# Altium schematic sheet MezzanineConnectors.SchDoc
size A3; SheetNumber: 2; SheetTotal: 6
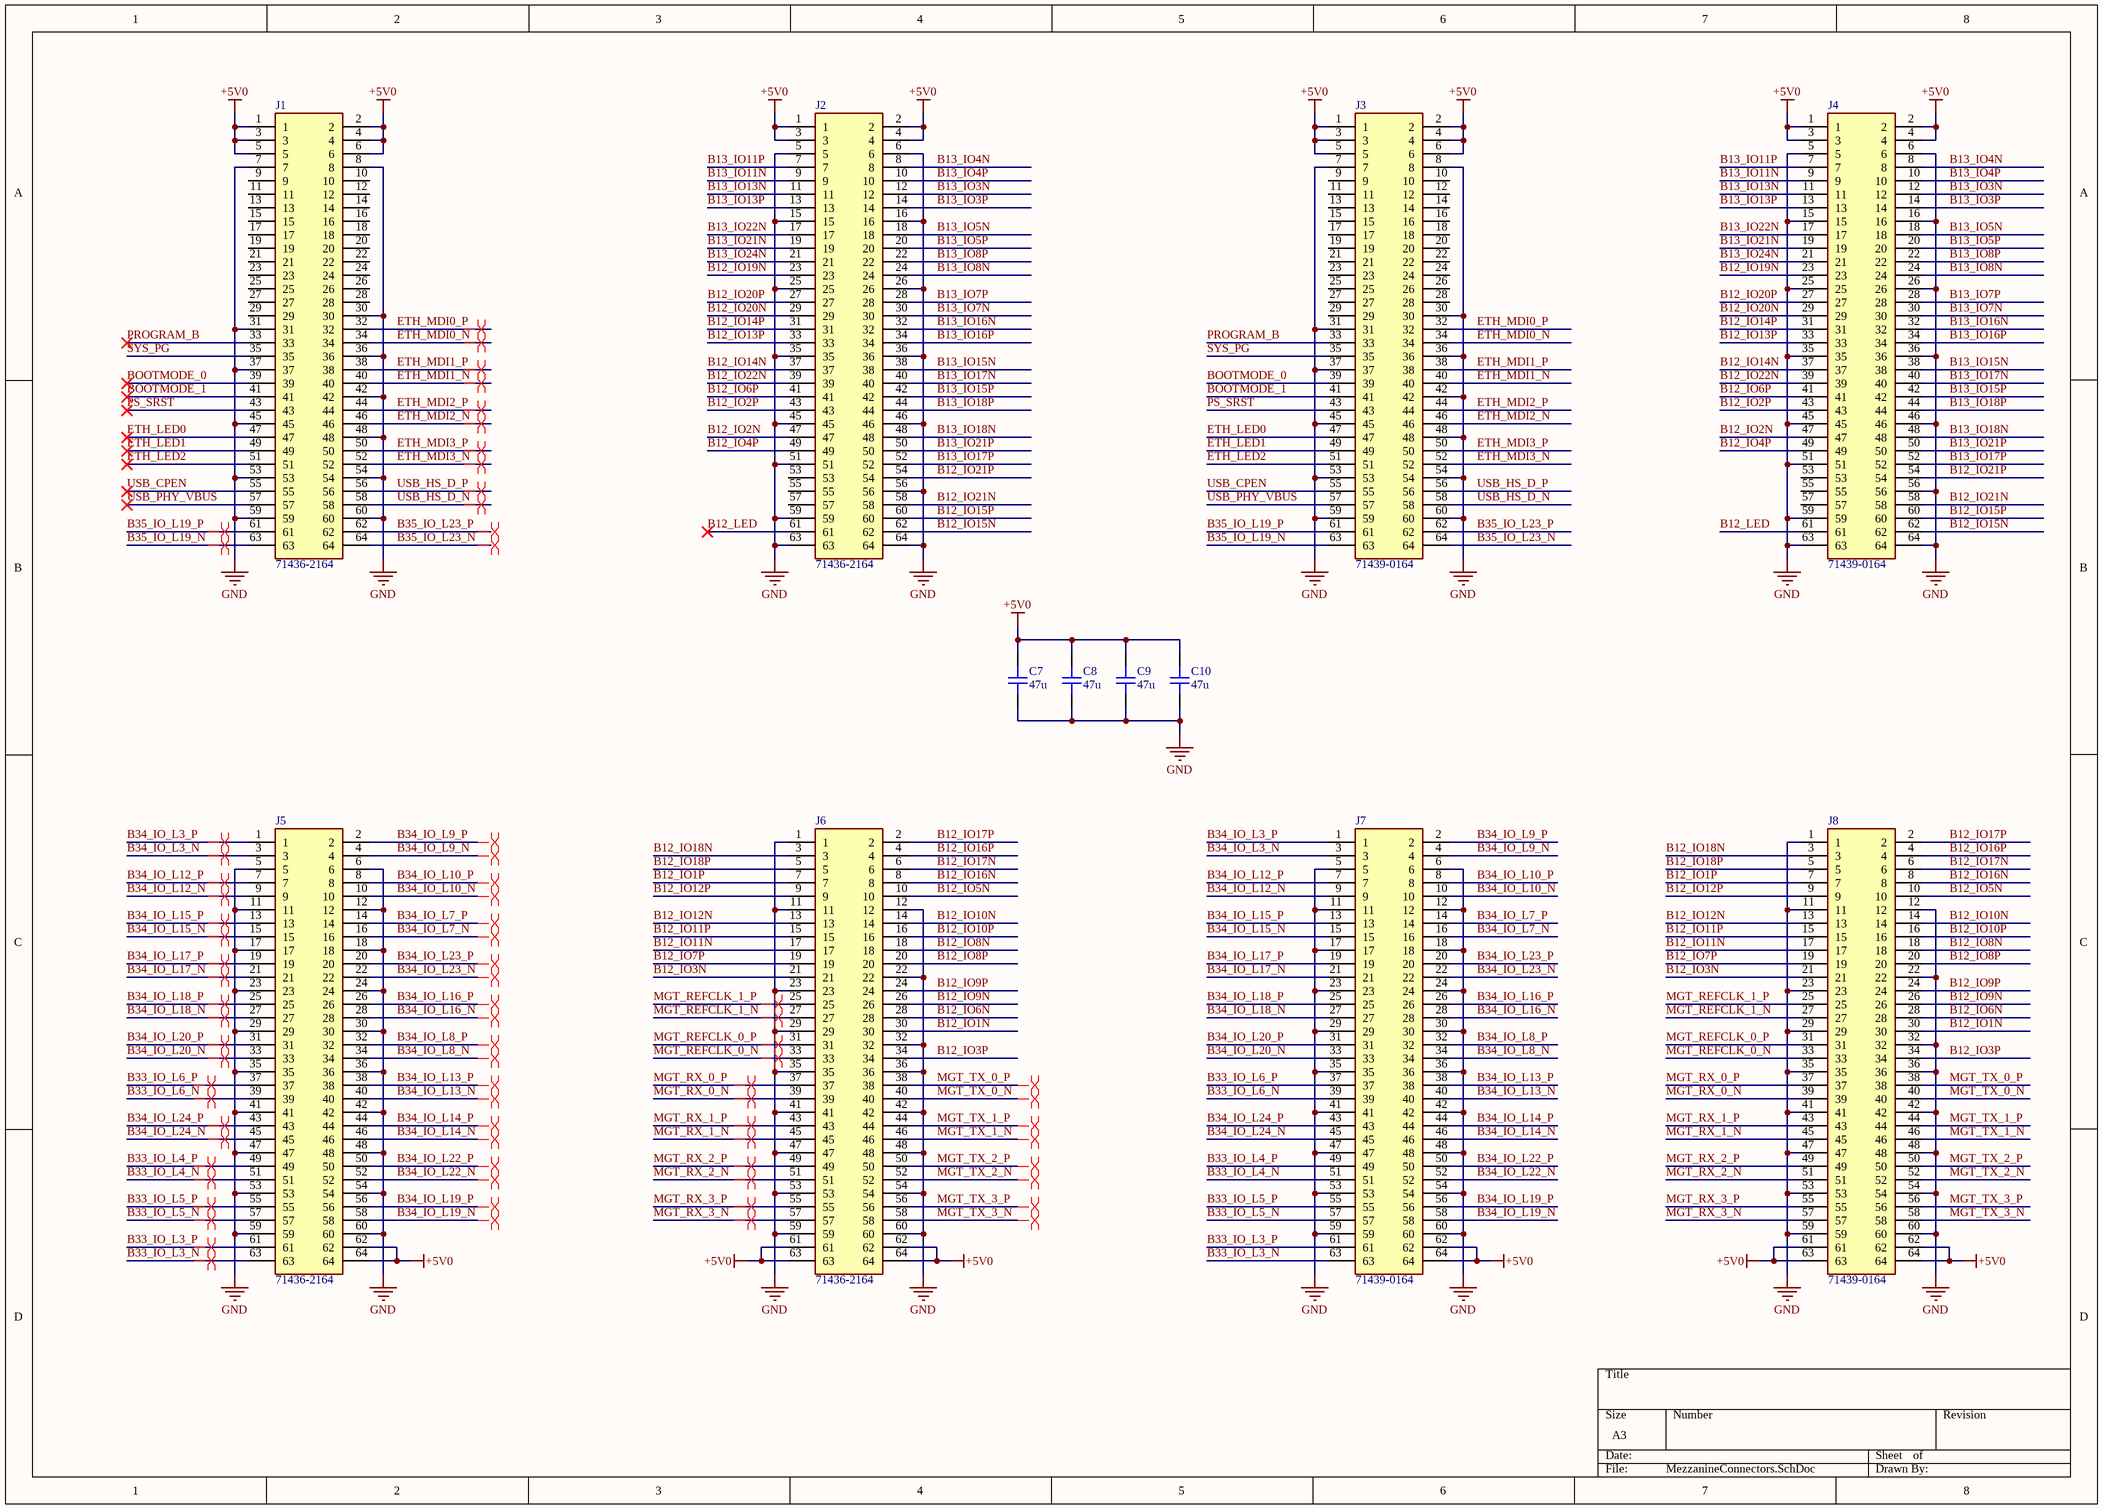
[diagram p0: MezzanineConnectors.SchDoc]

## Parts
C7  47u  [CAP_0805]
C8  47u  [CAP_0805]
C9  47u  [CAP_0805]
C10  47u  [CAP_0805]
J1  71436-2164  [714362164]
J2  71436-2164  [714362164]
J3  71439-0164  [714390164]
J4  71439-0164  [714390164]
J5  71436-2164  [714362164]
J6  71436-2164  [714362164]
J7  71439-0164  [714390164]
J8  71439-0164  [714390164]

## Nets
+5V0: C7.2 C8.2 C9.2 C10.2 J1.1 J1.2 J1.3 J1.4 J1.5 J1.6 J2.1 J2.2 J2.3 J2.4 J3.1 J3.2 J3.3 J3.4 J3.5 J3.6 J4.1 J4.2 J4.3 J4.4 J5.62 J5.64 J6.61 J6.62 J6.63 J6.64 J7.62 J7.64 J8.61 J8.62 J8.63 J8.64
GND: C7.1 C8.1 C9.1 C10.1 J1.7 J1.8 J1.30 J1.31 J1.36 J1.37 J1.42 J1.45 J1.48 J1.53 J1.54 J1.59 J1.60 J2.5 J2.6 J2.15 J2.16 J2.25 J2.26 J2.35 J2.36 J2.45 J2.46 J2.51 J2.56 J2.59 J2.63 J2.64 J3.7 J3.8 J3.30 J3.31 J3.36 J3.37 J3.42 J3.45 J3.48 J3.53 J3.54 J3.59 J3.60 J4.5 J4.6 J4.15 J4.16 J4.25 J4.26 J4.35 J4.36 J4.45 J4.46 J4.51 J4.56 J4.59 J4.63 J4.64 J5.5 J5.6 J5.11 J5.12 J5.17 J5.18 J5.23 J5.24 J5.29 J5.30 J5.35 J5.36 J5.41 J5.42 J5.47 J5.48 J5.53 J5.54 J5.59 J5.60 J6.1 J6.11 J6.12 J6.22 J6.23 J6.29 J6.32 J6.35 J6.36 J6.41 J6.42 J6.47 J6.48 J6.53 J6.54 J6.59 J6.60 J7.5 J7.6 J7.11 J7.12 J7.17 J7.18 J7.23 J7.24 J7.29 J7.30 J7.35 J7.36 J7.41 J7.42 J7.47 J7.48 J7.53 J7.54 J7.59 J7.60 J8.1 J8.11 J8.12 J8.22 J8.23 J8.29 J8.32 J8.35 J8.36 J8.41 J8.42 J8.47 J8.48 J8.53 J8.54 J8.59 J8.60
B12_IO1N: J6.30 J8.30
B12_IO1P: J6.7 J8.7
B12_IO2N: J2.47 J4.47
B12_IO2P: J2.43 J4.43
B12_IO3N: J6.21 J8.21
B12_IO3P: J6.34 J8.34
B12_IO4P: J2.49 J4.49
B12_IO5N: J6.10 J8.10
B12_IO6N: J6.28 J8.28
B12_IO6P: J2.41 J4.41
B12_IO7P: J6.19 J8.19
B12_IO8N: J6.18 J8.18
B12_IO8P: J6.20 J8.20
B12_IO9N: J6.26 J8.26
B12_IO9P: J6.24 J8.24
B12_IO10N: J6.14 J8.14
B12_IO10P: J6.16 J8.16
B12_IO11N: J6.17 J8.17
B12_IO11P: J6.15 J8.15
B12_IO12N: J6.13 J8.13
B12_IO12P: J6.9 J8.9
B12_IO13P: J2.33 J4.33
B12_IO14N: J2.37 J4.37
B12_IO14P: J2.31 J4.31
B12_IO15N: J2.62 J4.62
B12_IO15P: J2.60 J4.60
B12_IO16N: J6.8 J8.8
B12_IO16P: J6.4 J8.4
B12_IO17N: J6.6 J8.6
B12_IO17P: J6.2 J8.2
B12_IO18N: J6.3 J8.3
B12_IO18P: J6.5 J8.5
B12_IO19N: J2.23 J4.23
B12_IO20N: J2.29 J4.29
B12_IO20P: J2.27 J4.27
B12_IO21N: J2.58 J4.58
B12_IO21P: J2.54 J4.54
B12_IO22N: J2.39 J4.39
B12_LED: J2.61 J4.61
B13_IO3N: J2.12 J4.12
B13_IO3P: J2.14 J4.14
B13_IO4N: J2.8 J4.8
B13_IO4P: J2.10 J4.10
B13_IO5N: J2.18 J4.18
B13_IO5P: J2.20 J4.20
B13_IO7N: J2.30 J4.30
B13_IO7P: J2.28 J4.28
B13_IO8N: J2.24 J4.24
B13_IO8P: J2.22 J4.22
B13_IO11N: J2.9 J4.9
B13_IO11P: J2.7 J4.7
B13_IO13N: J2.11 J4.11
B13_IO13P: J2.13 J4.13
B13_IO15N: J2.38 J4.38
B13_IO15P: J2.42 J4.42
B13_IO16N: J2.32 J4.32
B13_IO16P: J2.34 J4.34
B13_IO17N: J2.40 J4.40
B13_IO17P: J2.52 J4.52
B13_IO18N: J2.48 J4.48
B13_IO18P: J2.44 J4.44
B13_IO21N: J2.19 J4.19
B13_IO21P: J2.50 J4.50
B13_IO22N: J2.17 J4.17
B13_IO24N: J2.21 J4.21
B33_IO_L3_N: J5.63 J7.63
B33_IO_L3_P: J5.61 J7.61
B33_IO_L4_N: J5.51 J7.51
B33_IO_L4_P: J5.49 J7.49
B33_IO_L5_N: J5.57 J7.57
B33_IO_L5_P: J5.55 J7.55
B33_IO_L6_N: J5.39 J7.39
B33_IO_L6_P: J5.37 J7.37
B34_IO_L3_N: J5.3 J7.3
B34_IO_L3_P: J5.1 J7.1
B34_IO_L7_N: J5.16 J7.16
B34_IO_L7_P: J5.14 J7.14
B34_IO_L8_N: J5.34 J7.34
B34_IO_L8_P: J5.32 J7.32
B34_IO_L9_N: J5.4 J7.4
B34_IO_L9_P: J5.2 J7.2
B34_IO_L10_N: J5.10 J7.10
B34_IO_L10_P: J5.8 J7.8
B34_IO_L12_N: J5.9 J7.9
B34_IO_L12_P: J5.7 J7.7
B34_IO_L13_N: J5.40 J7.40
B34_IO_L13_P: J5.38 J7.38
B34_IO_L14_N: J5.46 J7.46
B34_IO_L14_P: J5.44 J7.44
B34_IO_L15_N: J5.15 J7.15
B34_IO_L15_P: J5.13 J7.13
B34_IO_L16_N: J5.28 J7.28
B34_IO_L16_P: J5.26 J7.26
B34_IO_L17_N: J5.21 J7.21
B34_IO_L17_P: J5.19 J7.19
B34_IO_L18_N: J5.27 J7.27
B34_IO_L18_P: J5.25 J7.25
B34_IO_L19_N: J5.58 J7.58
B34_IO_L19_P: J5.56 J7.56
B34_IO_L20_N: J5.33 J7.33
B34_IO_L20_P: J5.31 J7.31
B34_IO_L22_N: J5.52 J7.52
B34_IO_L22_P: J5.50 J7.50
B34_IO_L23_N: J5.22 J7.22
B34_IO_L23_P: J5.20 J7.20
B34_IO_L24_N: J5.45 J7.45
B34_IO_L24_P: J5.43 J7.43
B35_IO_L19_N: J1.63 J3.63
B35_IO_L19_P: J1.61 J3.61
B35_IO_L23_N: J1.64 J3.64
B35_IO_L23_P: J1.62 J3.62
BOOTMODE_0: J1.39 J3.39
BOOTMODE_1: J1.41 J3.41
ETH_LED0: J1.47 J3.47
ETH_LED1: J1.49 J3.49
ETH_LED2: J1.51 J3.51
ETH_MDI0_N: J1.34 J3.34
ETH_MDI0_P: J1.32 J3.32
ETH_MDI1_N: J1.40 J3.40
ETH_MDI1_P: J1.38 J3.38
ETH_MDI2_N: J1.46 J3.46
ETH_MDI2_P: J1.44 J3.44
ETH_MDI3_N: J1.52 J3.52
ETH_MDI3_P: J1.50 J3.50
MGT_REFCLK_0_N: J6.33 J8.33
MGT_REFCLK_0_P: J6.31 J8.31
MGT_REFCLK_1_N: J6.27 J8.27
MGT_REFCLK_1_P: J6.25 J8.25
MGT_RX_0_N: J6.39 J8.39
MGT_RX_0_P: J6.37 J8.37
MGT_RX_1_N: J6.45 J8.45
MGT_RX_1_P: J6.43 J8.43
MGT_RX_2_N: J6.51 J8.51
MGT_RX_2_P: J6.49 J8.49
MGT_RX_3_N: J6.57 J8.57
MGT_RX_3_P: J6.55 J8.55
MGT_TX_0_N: J6.40 J8.40
MGT_TX_0_P: J6.38 J8.38
MGT_TX_1_N: J6.46 J8.46
MGT_TX_1_P: J6.44 J8.44
MGT_TX_2_N: J6.52 J8.52
MGT_TX_2_P: J6.50 J8.50
MGT_TX_3_N: J6.58 J8.58
MGT_TX_3_P: J6.56 J8.56
PROGRAM_B: J1.33 J3.33
PS_SRST: J1.43 J3.43
SYS_PG: J1.35 J3.35
USB_CPEN: J1.55 J3.55
USB_HS_D_N: J1.58 J3.58
USB_HS_D_P: J1.56 J3.56
USB_PHY_VBUS: J1.57 J3.57

Not connected (* = marked no-connect by the designer): J1 9 10 11 12 13 14 15 16 17 18 19 20 21 22 23 24 25 26 27 28 29; J2 53 55 57; J3 9 10 11 12 13 14 15 16 17 18 19 20 21 22 23 24 25 26 27 28 29; J4 53 55 57

## Layout directives
differential pair: B33_IO_L3_N, B33_IO_L3_P, B33_IO_L4_N, B33_IO_L4_P, B33_IO_L5_N, B33_IO_L5_P, B33_IO_L6_N, B33_IO_L6_P, B34_IO_L3_N, B34_IO_L3_P, B34_IO_L7_N, B34_IO_L7_P, B34_IO_L8_N, B34_IO_L8_P, B34_IO_L9_N, B34_IO_L9_P, B34_IO_L10_N, B34_IO_L10_P, B34_IO_L12_N, B34_IO_L12_P, B34_IO_L13_N, B34_IO_L13_P, B34_IO_L14_N, B34_IO_L14_P, B34_IO_L15_N, B34_IO_L15_P, B34_IO_L16_N, B34_IO_L16_P, B34_IO_L17_N, B34_IO_L17_P, B34_IO_L18_N, B34_IO_L18_P, B34_IO_L19_N, B34_IO_L19_P, B34_IO_L20_N, B34_IO_L20_P, B34_IO_L22_N, B34_IO_L22_P, B34_IO_L23_N, B34_IO_L23_P, B34_IO_L24_N, B34_IO_L24_P, B35_IO_L19_N, B35_IO_L19_P, B35_IO_L23_N, B35_IO_L23_P, ETH_MDI0_N, ETH_MDI0_P, ETH_MDI1_N, ETH_MDI1_P, ETH_MDI2_N, ETH_MDI2_P, ETH_MDI3_N, ETH_MDI3_P, MGT_REFCLK_0_N, MGT_REFCLK_0_P, MGT_REFCLK_1_N, MGT_REFCLK_1_P, MGT_RX_0_N, MGT_RX_0_P, MGT_RX_1_N, MGT_RX_1_P, MGT_RX_2_N, MGT_RX_2_P, MGT_RX_3_N, MGT_RX_3_P, MGT_TX_0_N, MGT_TX_0_P, MGT_TX_1_N, MGT_TX_1_P, MGT_TX_2_N, MGT_TX_2_P, MGT_TX_3_N, MGT_TX_3_P, USB_HS_D_N, USB_HS_D_P

## Library data of the parts
C7-C10 = CAP_0805: Capacitor SMD 0805; Manufacturer: *; Manufacturer Part Number: *; Distributor Link: *; LCSC: *; Rating: *; Dielectric: *
J1 J2 J5 J6 = 71436-2164: Molex MEZZANINE Series, Series Number 71436, 1mm Pitch 64 Way 2 Row Straight PCB Header, Solder Termination, 1A; Geometry.Height: 8.48mm; Mouser Part Number: 538-71436-2164; Mouser Price/Stock: https://www.mouser.co.uk/ProductDetail/Molex/71436-2164?qs=X1mjqRbeMc536fw4qEA%252B%252Bg%3D%3D; Manufacturer_Name: Molex; Manufacturer_Part_Number: 71436-2164; Datasheet Link: *
J3 J4 J7 J8 = 71439-0164: Board to Board & Mezzanine Connectors PMC RECEPTACLE SMT; Manufacturer_Name: Molex; Datasheet Link: https://componentsearchengine.com/Datasheets/1/71439-0164.pdf; Height: 5.3mm; Manufacturer_Part_Number: 71439-0164; Mouser Part Number: 538-71439-0164; Mouser Price/Stock: https://www.mouser.co.uk/ProductDetail/Molex/71439-0164?qs=X1mjqRbeMc7uGUsAO8ttVw%3D%3D